# EasyEDA schematic Board_scheme.json
TITLE: Sheet_2; REV: 1.0; Date: 2025-11-05; Sheet: 1/1; Drawn By: nikita_dr; Company: Your Company
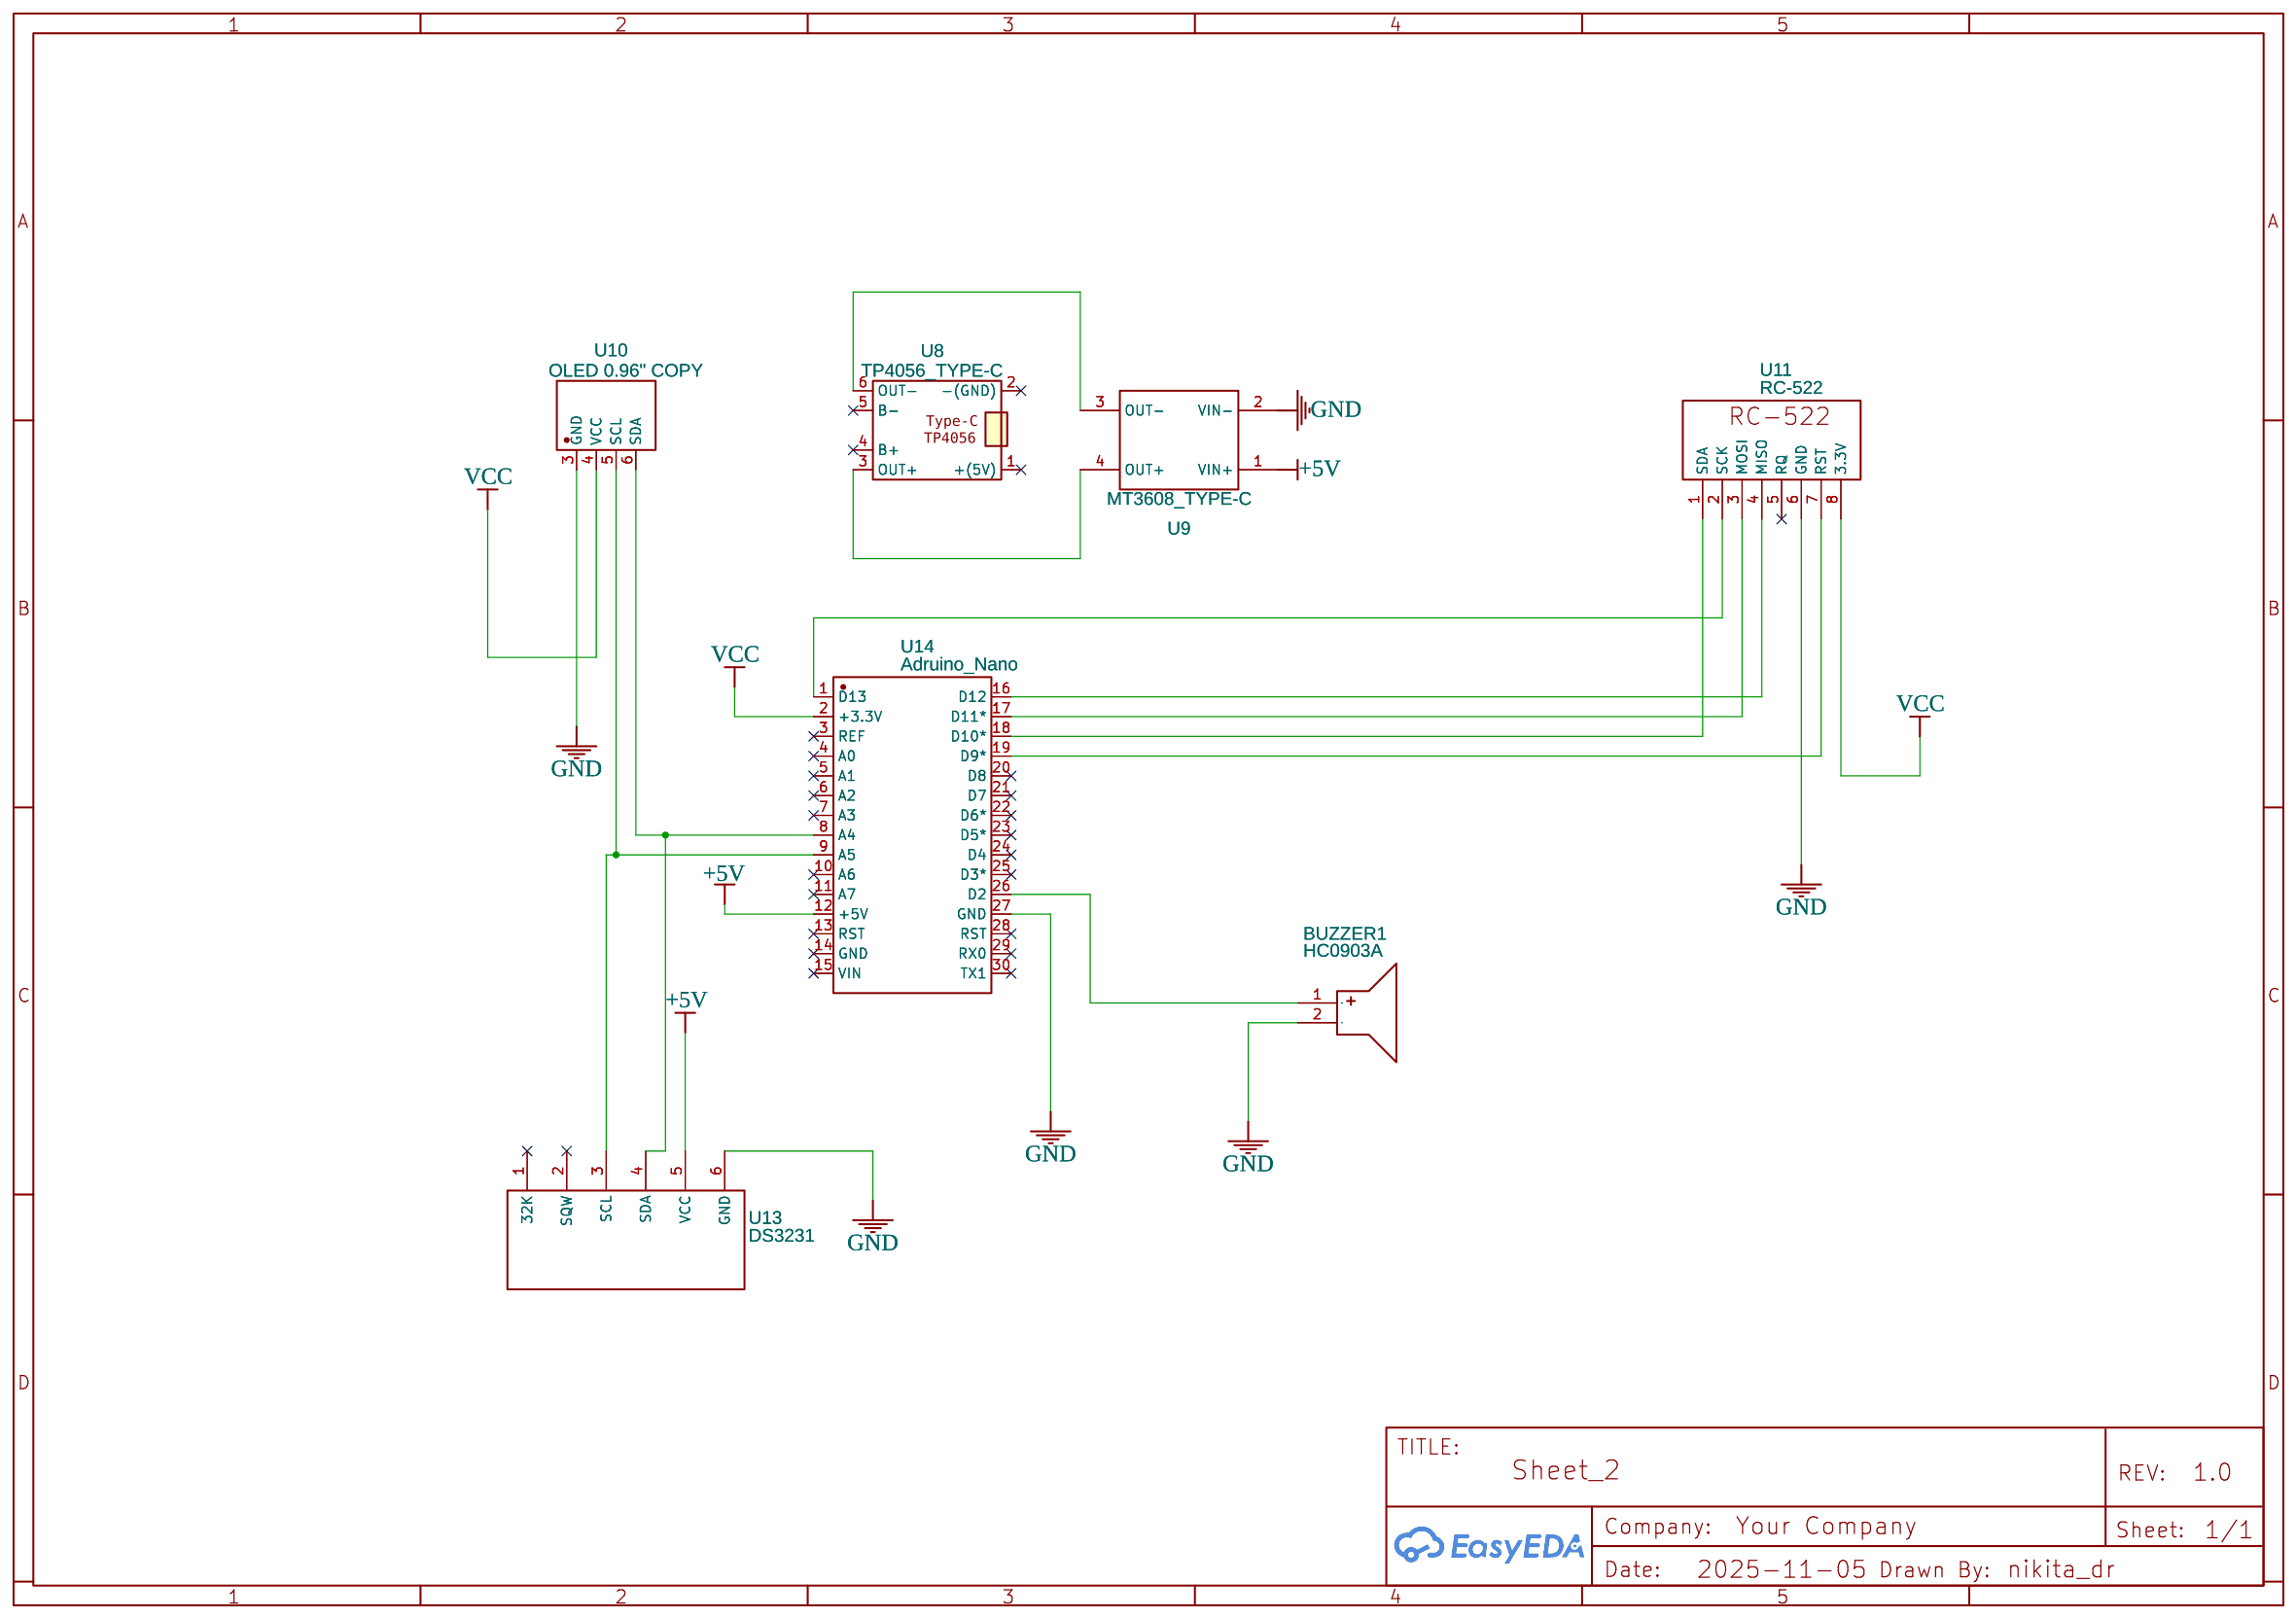
[diagram p0: schematic sheet]

## Parts
BUZZER1  HC0903A  [HC0903A]
U8  TP4056_TYPE-C  [TP4056_TYPE-C]
U9  MT3608_TYPE-C  [MT3608_TYPE-C]
U10  OLED 0.96" COPY  [OLED-TH_OLED0.96-I2C]
U11  RC-522  [RC-522]
U13  DS3231  [DS3231]
U14  Adruino_Nano  [ADRUINO_NANO]

## Library data of the parts
BUZZER1 = HC0903A: Manufacturer: INGHAi; Contributor: Anatoliy Antonov; LCSC Assembly: Yes; SMT Type: Extend; Paste Type: expand
U8 = TP4056_TYPE-C: Contributor: Алексей Ботов
U9 = MT3608_TYPE-C: Manufacturer: Simple Robot Store; Supplier: Aliexpress; link: https://www.aliexpress.com/item/32366166138.html?spm=a2g0o.order_list.order_list_main.4.32d91802zskEih; Contributor: info.engrusman
U10 = OLED 0.96" COPY: Supplier Part: AZDelivery; Manufacturer: AZDelivery; Manufacturer Part: ZJY096S0700BG01蓝色; link: https://img.jlc.com/pdf/applyPasteComponent/2022-08-15/203417A/337c2d88c1b34c958220578f8c1ccd46/ZJY096S0700WG01.pdf; Contributor: tonysandberg69
U11 = RC-522: Supplier Part: undefined; Contributor: Владимир Запесочный
U13 = DS3231: Manufacturer Part: New SchematicLib; Contributor: Vakhtang
U14 = Adruino_Nano: Contributor: noOne007

## Nets
+5V: U9.1(VIN+) U13.5(VCC) U14.12(+5V)
GND: BUZZER1.2(-) U9.2(VIN-) U10.3(GND) U11.6(GND) U13.6(GND) U14.27(GND)
VCC: U10.4(VCC) U11.8(3.3V) U14.2(+3.3V)
Net-(BUZZER1-1): BUZZER1.1(+) U14.26(D2)
Net-(U8-3): U8.3(OUT+) U9.4(OUT+)
Net-(U8-6): U8.6(OUT-) U9.3(OUT-)
Net-(U10-5): U10.5(SCL) U13.3(SCL) U14.9(A5)
Net-(U10-6): U10.6(SDA) U13.4(SDA) U14.8(A4)
Net-(U11-1): U11.1(SDA) U14.18(D10*)
Net-(U11-2): U11.2(SCK) U14.1(D13)
Net-(U11-3): U11.3(MOSI) U14.17(D11*)
Net-(U11-4): U11.4(MISO) U14.16(D12)
Net-(U11-7): U11.7(RST) U14.19(D9*)

Not connected (* = marked no-connect by the designer): U8 1(+(5V))* 2(-(GND))* 4(B+)* 5(B-)*; U11 5(RQ)*; U13 1(32K)* 2(SQW)*; U14 3(REF)* 4(A0)* 5(A1)* 6(A2)* 7(A3)* 10(A6)* 11(A7)* 13(RST)* 14(GND)* 15(VIN)* 20(D8)* 21(D7)* 22(D6*)* 23(D5*)* 24(D4)* 25(D3*)* 28(RST)* 29(RX0)* 30(TX1)*
